# EAGLE design gba link (EAGLE 9.6.2)
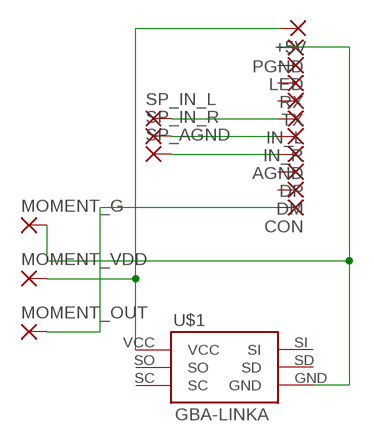
[diagram p0: schematic, sheet 1]

## Parts
+5V  SMD2  [SMD1,27-2,54]
AGND  SMD2  [SMD1,27-2,54]
CON  SMD2  [SMD1,27-2,54]
DM  SMD2  [SMD1,27-2,54]
DP  SMD2  [SMD1,27-2,54]
IN_L  SMD2  [SMD1,27-2,54]
IN_R  SMD2  [SMD1,27-2,54]
LED  SMD2  [SMD1,27-2,54]
MOMENT_G  2,15/1,0  [2,15/1,0]
MOMENT_OUT  2,15/1,0  [2,15/1,0]
MOMENT_VDD  2,15/1,0  [2,15/1,0]
PGND  SMD2  [SMD1,27-2,54]
RX  SMD2  [SMD1,27-2,54]
SP_AGND  2,15/1,0  [2,15/1,0]
SP_IN_L  2,15/1,0  [2,15/1,0]
SP_IN_R  2,15/1,0  [2,15/1,0]
TX  SMD2  [SMD1,27-2,54]
U$1  GBA-LINKA  [GBA-LINK-ALT]

## Nets
N$1 [New Class]: +5V.1(P) MOMENT_VDD.1(P) U$1.VCC
N$2 [New Class]: MOMENT_G.1(P) PGND.1(P) U$1.GND
N$3: AGND.1(P) SP_AGND.1(P)
N$4: IN_R.1(P) SP_IN_R.1(P)
N$5: IN_L.1(P) SP_IN_L.1(P)
N$6: CON.1(P) MOMENT_OUT.1(P)
Unconnected: DM.1(P) DP.1(P) LED.1(P) RX.1(P) TX.1(P) U$1.S$1 U$1.S$2(S$1) U$1.SC U$1.SD U$1.SI U$1.SO

## Library data of the parts
+5V AGND CON DM DP IN_L IN_R LED PGND RX TX = wirepad2:SMD2: SMD PAD
MOMENT_G MOMENT_OUT MOMENT_VDD SP_AGND SP_IN_L SP_IN_R = wirepad2:2,15/1,0: THROUGH-HOLE PAD
U$1 = Catskulls_link_portMirror:GBA-LINK

## Net classes
0 default: width 0.508 mm
1 New Class: width 0.508 mm

## Board
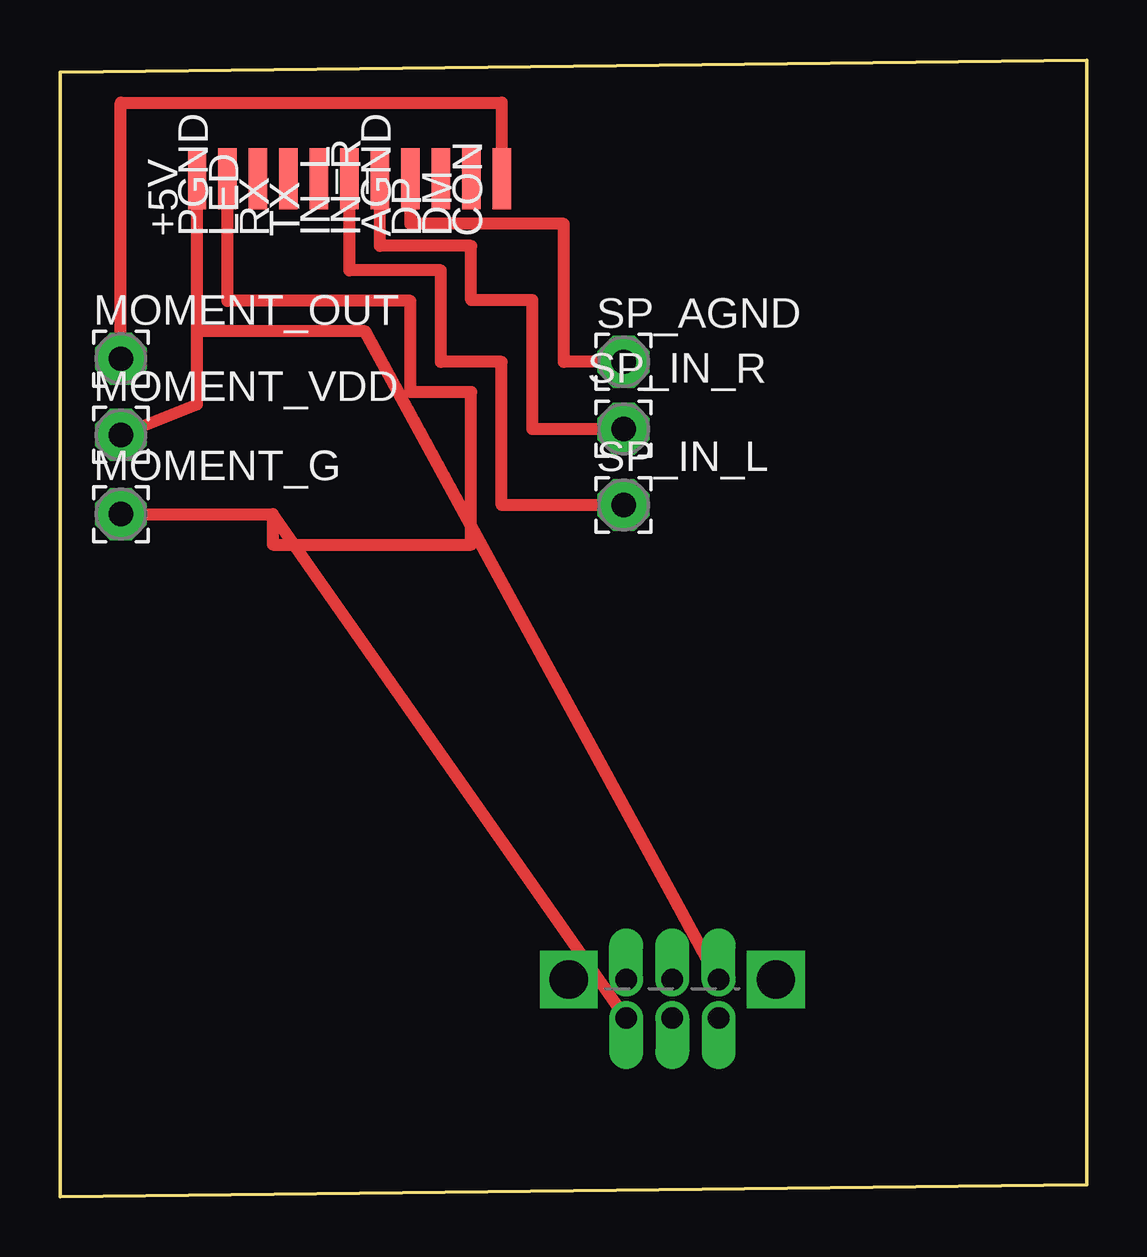
[diagram p1: board, top side]

Size 42.8 x 47.37 mm. Coordinates in mm from the lower left corner, seen from the top.
Outline: 0,46.86 0,0 42.8,0.51 42.8,47.37 0,46.86
Copper layers (1*16): Top 0.035mm / dielectric 1.5mm / Bottom 0.035mm
Design rules "OthermillDRC_30_deg_v2": minimum track width 6mil, minimum drill 0.8mm, track to track 6mil, track to pad 6mil, pad to pad 6mil, via to via 6mil, smd to smd 0mil, copper to edge 0mil, drill to drill 6mil, minimum pad ring 10mil, minimum via ring 10mil, stop-mask expansion 1mil, vias tented up to drill 30mil, thermal gap 6mil

### Footprints (pad centres in the part's own frame; a part is rotated, then mirrored left to right if it is on the bottom)
SMD1,27-2,54 = smd 0.762 x 2.54: 1 0,0
2,15/1,0 = drill 1.016 pad 2.159 octagon: 1 0,0
GBA-LINK-ALT = drill 0.9 pad 1.27 offset: GND -1.93,-1.61; SC -1.93,0; SD 0,-1.61; SI 0,0; SO 1.93,-1.61; VCC 1.93,0 | drill 1.6 pad 2.184 square: S$1 -4.318,0; S$2 4.318,0

### Placement (x,y rotation side)
+5V  5.71,42.42 0 top
AGND  14.6,42.42 0 top
CON  18.41,42.42 0 top
DM  17.14,42.42 0 top
DP  15.87,42.42 0 top
IN_L  12.06,42.42 0 top
IN_R  13.33,42.42 0 top
LED  8.25,42.42 0 top
MOMENT_G  2.54,28.45 0 top
MOMENT_OUT  2.54,34.92 0 top
MOMENT_VDD  2.54,31.75 0 top
PGND  6.98,42.42 0 top
RX  9.52,42.42 0 top
SP_AGND  23.49,34.8 0 top
SP_IN_L  23.49,28.83 0 top
SP_IN_R  23.49,32 0 top
TX  10.79,42.42 0 top
U$1  25.53,9.06 0 top

### Tracks (layer width: path | path; a pad name or v marks a point on that pad's centre or on a via)
N$1
  Top 0.508: U$1.VCC 12.72,36.07 5.71,36.07 | 5.71,36.07 +5V.1 | MOMENT_VDD.1 5.71,33.02 5.71,36.07
N$2
  Top 0.508: PGND.1 6.98,37.34 14.6,37.34 14.6,33.53 17.14,33.53 17.14,27.18 8.86,27.18 8.86,28.45 | U$1.GND 8.86,28.45 | MOMENT_G.1 8.86,28.45
N$3
  Top 0.508: SP_AGND.1 21.01,34.8 21.01,40.54 14.6,40.54 AGND.1
N$4
  Top 0.508: SP_IN_R.1 19.68,32 19.68,37.36 17.14,37.36 17.14,39.62 13.33,39.62 IN_R.1
N$5
  Top 0.508: SP_IN_L.1 18.41,28.83 18.41,34.8 15.87,34.8 15.87,38.61 12.06,38.61 IN_L.1
N$6
  Top 0.508: MOMENT_OUT.1 2.54,45.59 18.41,45.59 CON.1